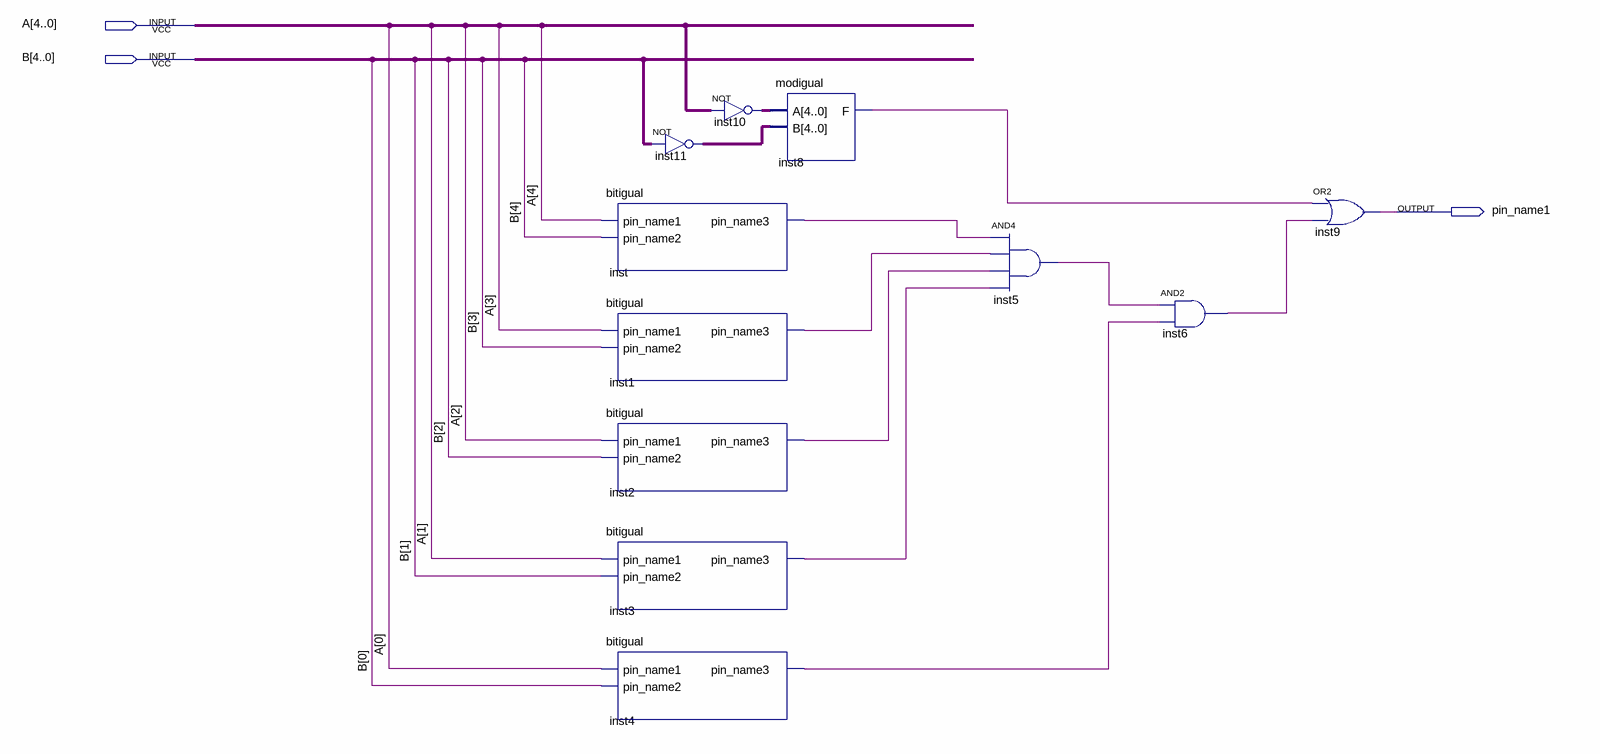
[diagram p0: schematic sheet]
// Quartus schematic numerosiguais.bdf as structural Verilog: 11 symbols, 3 pins
module numerosiguais (
  input  [4:0] A,
  input  [4:0] B,
  output pin_name1
);

  wire inst1_pin_name3, inst2_pin_name3, inst3_pin_name3, inst4_pin_name3, inst5_out, inst6_out, inst8_f,
       inst_pin_name3;
  wire [4:0] inst10_out, inst11_out;

  assign inst11_out = ~B;  // NOT inst11, 5 bits wide
  bitigual inst (.pin_name1(A[4]), .pin_name2(B[4]), .pin_name3(inst_pin_name3));
  bitigual inst1 (.pin_name1(A[3]), .pin_name2(B[3]), .pin_name3(inst1_pin_name3));
  bitigual inst2 (.pin_name1(A[2]), .pin_name2(B[2]), .pin_name3(inst2_pin_name3));
  bitigual inst3 (.pin_name1(A[1]), .pin_name2(B[1]), .pin_name3(inst3_pin_name3));
  bitigual inst4 (.pin_name1(A[0]), .pin_name2(B[0]), .pin_name3(inst4_pin_name3));
  assign inst10_out = ~A;  // NOT inst10, 5 bits wide
  modigual inst8 (.A(inst10_out), .B(inst11_out), .F(inst8_f));
  and inst5 (inst5_out, inst_pin_name3, inst1_pin_name3, inst2_pin_name3, inst3_pin_name3);
  and inst6 (inst6_out, inst5_out, inst4_pin_name3);
  or inst9 (pin_name1, inst8_f, inst6_out);
endmodule
